# Altium schematic sheet _light.SchDoc
size Tabloid
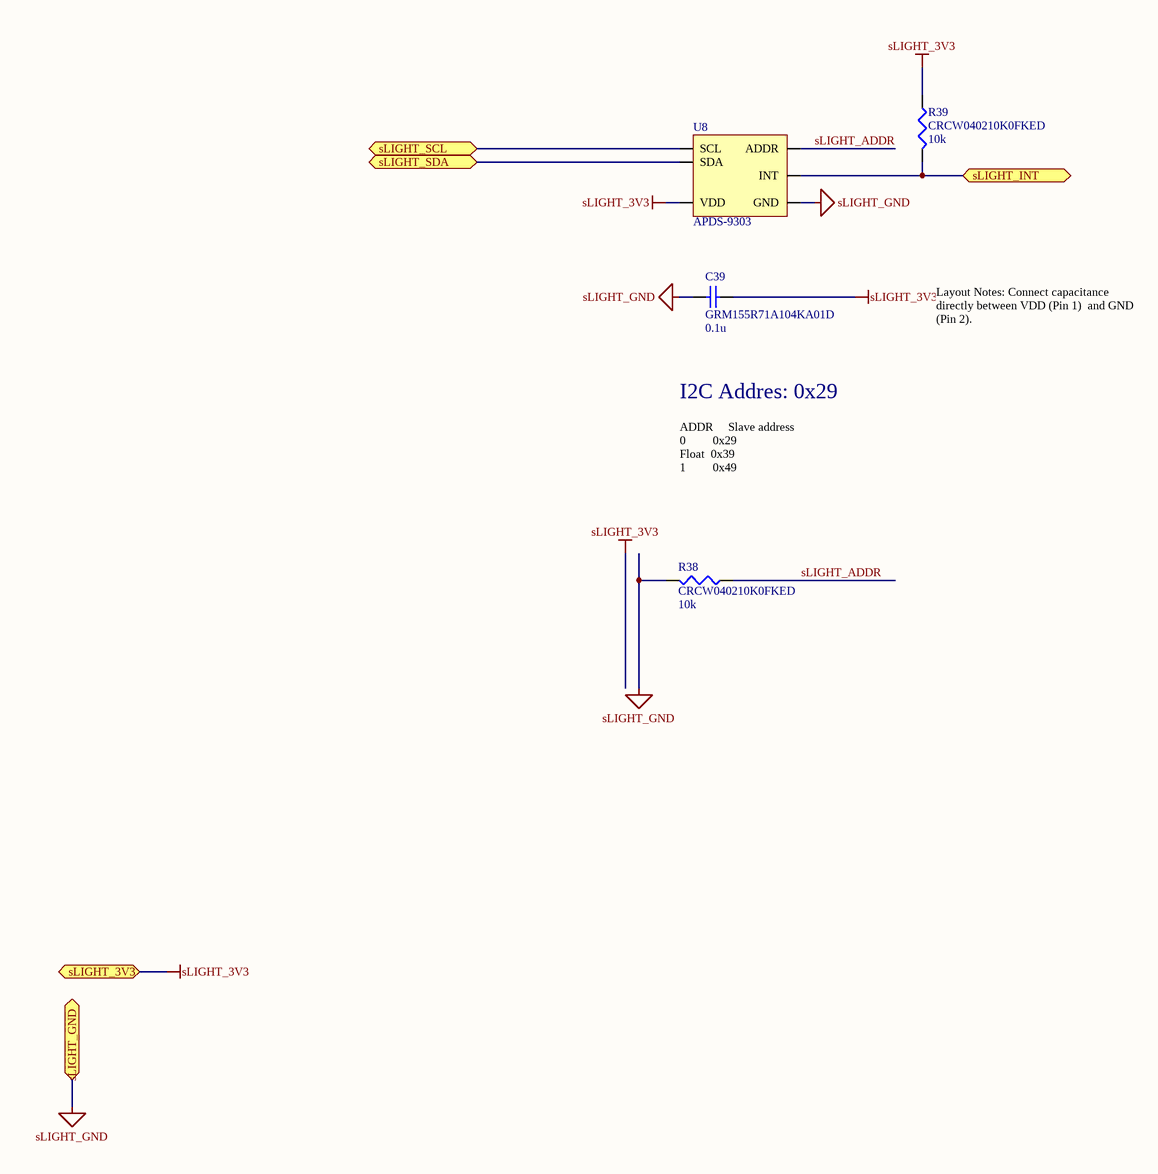
[diagram p0: _light.SchDoc]

## Parts
C39  GRM155R71A104KA01D  value 0.1u  [0402]
R38  CRCW040210K0FKED  value 10k  [0402]
R39  CRCW040210K0FKED  value 10k  [0402]
U8  APDS-9303  [APDS-9303]

## Ports
sLIGHT_3V3, sLIGHT_GND, sLIGHT_INT, sLIGHT_SCL, sLIGHT_SDA

## Nets
sLIGHT_3V3: C39.2 R39.1 U8.1(VDD) ; port sLIGHT_3V3
sLIGHT_GND: C39.1 R38.2 U8.2(GND) ; port sLIGHT_GND
sLIGHT_ADDR: R38.1 U8.3(ADDR)
sLIGHT_INT: R39.2 U8.6(INT) ; port sLIGHT_INT
sLIGHT_SCL: U8.4(SCL) ; port sLIGHT_SCL
sLIGHT_SDA: U8.5(SDA) ; port sLIGHT_SDA

## Notes on the sheet
- Layout Notes: Connect capacitance directly between VDD (Pin 1)  and GND (Pin 2).
- I2C Addres: 0x29
- ADDR     Slave address
  0         0x29
  Float  0x39
  1         0x49

## Library data of the parts
C39 = GRM155R71AxxxKdddd: -55-125C, 1005, 10V, X7R, ±10%
R38 R39 = CRCW0402xxxxFKED: 0.125W, -55-155C, 1005, 50V, ±1%